# Altium schematic sheet Sounder_Buzzer.SchDoc
size 50 x 30 mm
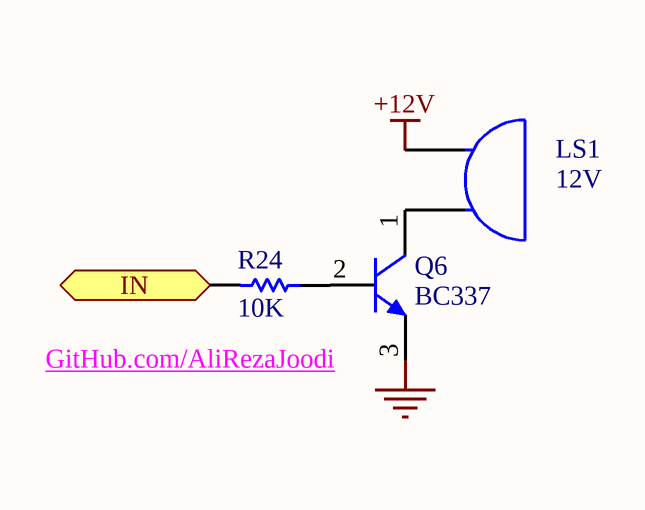
[diagram p0: Sounder_Buzzer.SchDoc]

## Parts
LS1  value 12V  [RB_7.62mm]  (hidden comment: Buzzer)
Q6  value BC337  [TO92C]  (hidden comment: NPN)
R24  value 10K  [AXIAL-0.4]  (hidden comment: Res1)

## Ports
IN (in)

## Nets
+12V: LS1.1(A)
GND: Q6.3(E)
IN: R24.2 ; port IN
NetLS1_2: LS1.2(B) Q6.1(C)
NetQ6_2: Q6.2(B) R24.1

## Notes on the sheet
- GitHub.com/AliRezaJoodi

## Library data of the parts
LS1 = Buzzer: Sounder; Manufacturer: Generic Components; Published: 24-Mar-1999; Revision: July-2002: Re-released for DXP Platform.; Publisher: Altium Limited
Q6 = NPN: NPN Bipolar Transistor; Manufacturer: Generic Components; Class I: Discrete; Class II: BJT - Low Power; Published: 8-Jun-2000; Revision: July-2002: Re-released for DXP Platform.; Publisher: Altium Limited
R24 = Res1: Resistor; Published: 8-Jun-2000; LatestRevisionDate: 17-Jul-2002; LatestRevisionNote: Re-released for DXP Platform.; PackageReference: AXIAL-0.3; Publisher: Altium Limited